# EAGLE design side_switches (EAGLE 5.07)
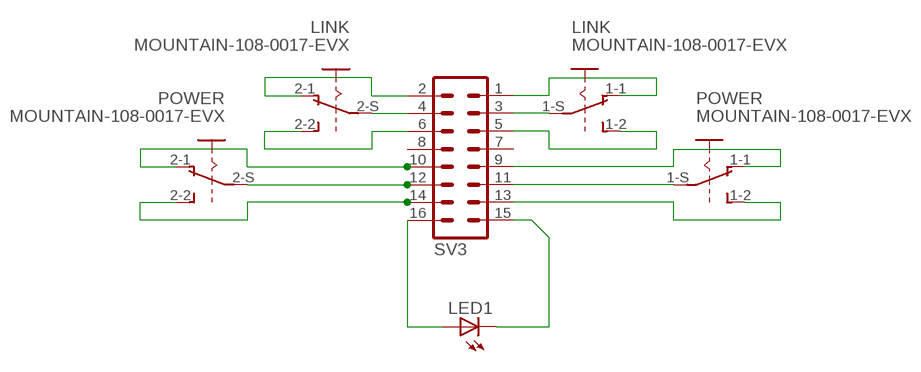
[diagram p0: schematic, sheet 1]

## Parts
LED1  LED3MM  [LED3MM]
LINK  MOUNTAIN-108-0017-EVX  [MOUNTAIN_108-0017-EVX]
POWER  MOUNTAIN-108-0017-EVX  [MOUNTAIN_108-0017-EVX]
SV3  MA08-2  [MA08-2]

## Nets
N$1: LINK.1-S(P) SV3.3
N$2: LINK.2-S(P) SV3.4
N$3: LINK.1-1(O) SV3.1
N$4: LINK.1-2(S) SV3.5
N$5: LINK.2-2(S) SV3.6
N$6: LINK.2-1(O) SV3.2
N$7: POWER.2-1(O) SV3.10
N$8: POWER.2-2(S) SV3.14
N$9: POWER.1-1(O) SV3.9
N$10: POWER.1-2(S) SV3.13
N$11: POWER.1-S(P) SV3.11
N$12: POWER.2-S(P) SV3.12
N$16: LED1.A SV3.16
N$17: LED1.K(C) SV3.15
Unconnected: SV3.7 SV3.8

## Library data of the parts
LED1 = led:LED: LED OSRAM: - CHIPLED LG R971, LG N971, LY N971, LG Q971, LY Q971, LO R971, LY R971 LH N974, LH R974 LS Q976, LO Q976, LY Q976 LO Q996 - Hyper CHIPLED LW Q18S LB Q993, LB Q99A, LB R99A - SideLED LS A670, LO A670, LY A670, LG A670, LP A670 LB A673, LV A673, LT A673, LW A673 LH A674 LY A675 LS A676, LA A676, LO A676, LY A676, LW A676 LS A679, LY A679, LG A679 - Hyper Micro SIDELED® LS Y876, LA Y876, LO Y876, LY Y876 LT Y87S - SmartLED LW L88C, LW L88S LB L89C, LB L89S, LG L890 LS L89K, LO L89K, LY L89K LS L896, LA L896, LO L896, LY L896 - TOPLED LS T670, LO T670, LY T670, LG T670, LP T670 LSG T670, LSP T670, LSY T670, LOP T670, LYG T670 LG T671, LOG T671, LSG T671 LB T673, LV T673, LT T673, LW T673 LH T674 LS T676, LA T676, LO T676, LY T676, LB T676, LH T676, LSB T676, LW T676 LB T67C, LV T67C, LT T67C, LS T67K, LO T67K, LY T67K, LW E67C LS E67B, LA E67B, LO E67B, LY E67B, LB E67C, LV E67C, LT E67C LW T67C LS T679, LY T679, LG T679 LS T770, LO T770, LY T770, LG T770, LP T770 LB T773, LV T773, LT T773, LW T773 LH T774 LS E675, LA E675, LY E675, LS T675 LS T776, LA T776, LO T776, LY T776, LB T776 LHGB T686 LT T68C, LB T68C - Hyper Mini TOPLED® LB M676 - Mini TOPLED Santana® LG M470 LS M47K, LO M47K, LY M47K Source: http://www.osram.convergy.de LUXEON: - LUMILED® LXK2-PW12-R00, LXK2-PW12-S00, LXK2-PW14-U00, LXK2-PW14-V00 LXK2-PM12-R00, LXK2-PM12-S00, LXK2-PM14-U00 LXK2-PE12-Q00, LXK2-PE12-R00, LXK2-PE12-S00, LXK2-PE14-T00, LXK2-PE14-U00 LXK2-PB12-K00, LXK2-PB12-L00, LXK2-PB12-M00, LXK2-PB14-N00, LXK2-PB14-P00, LXK2-PB14-Q00 LXK2-PR12-L00, LXK2-PR12-M00, LXK2-PR14-Q00, LXK2-PR14-R00 LXK2-PD12-Q00, LXK2-PD12-R00, LXK2-PD12-S00 LXK2-PH12-R00, LXK2-PH12-S00 LXK2-PL12-P00, LXK2-PL12-Q00, LXK2-PL12-R00 Source: www.luxeon.com KINGBRIGHT: KA-3528ASYC Source: www.kingbright.com
LINK POWER = joakim:MOUNTAIN-108-0017-EVX: Mountain 108-0017-evx switch
SV3 = con-lstb:MA08-2: PIN HEADER

## Board
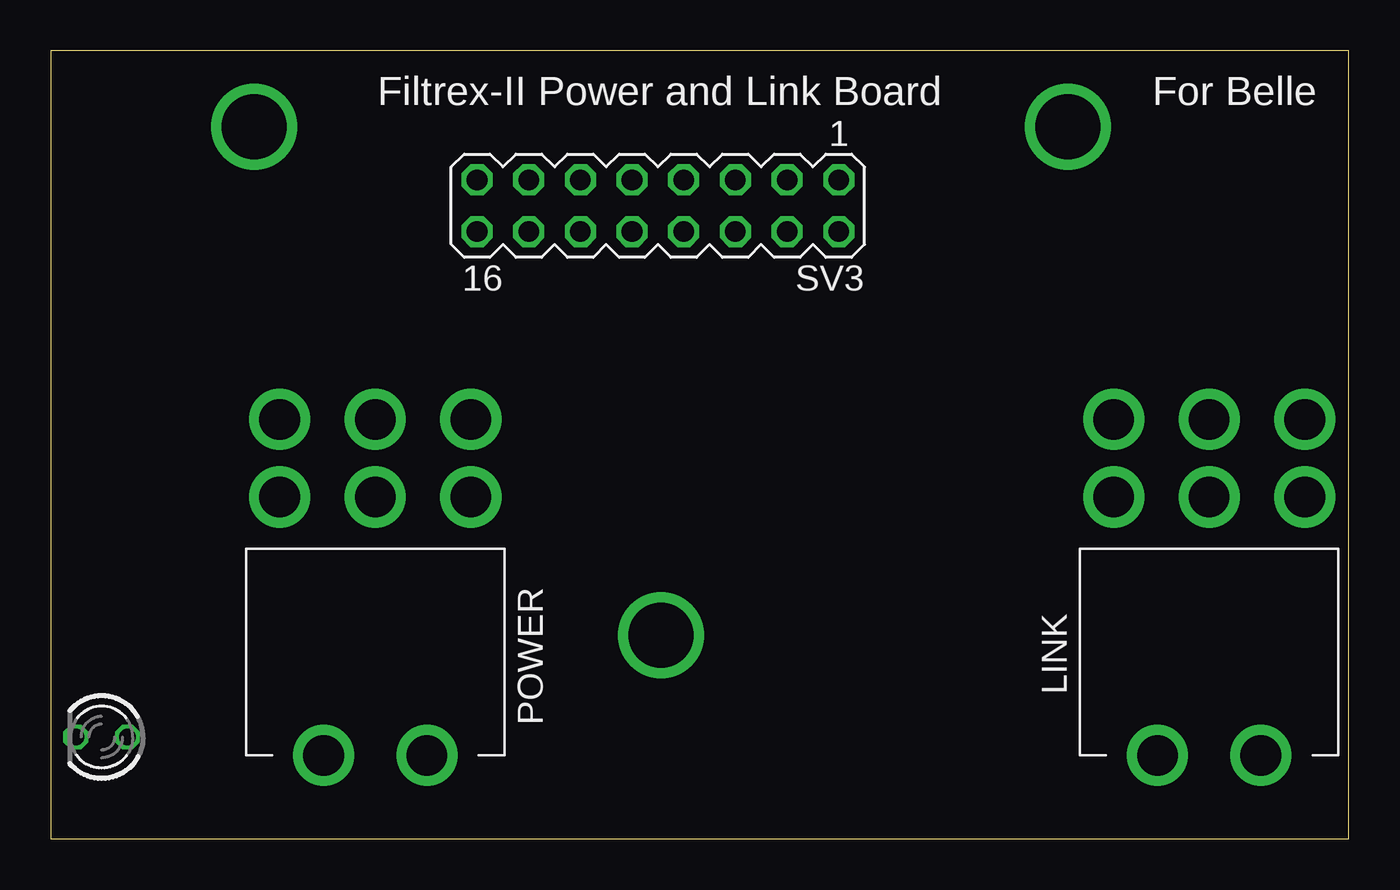
[diagram p1: board, top side]
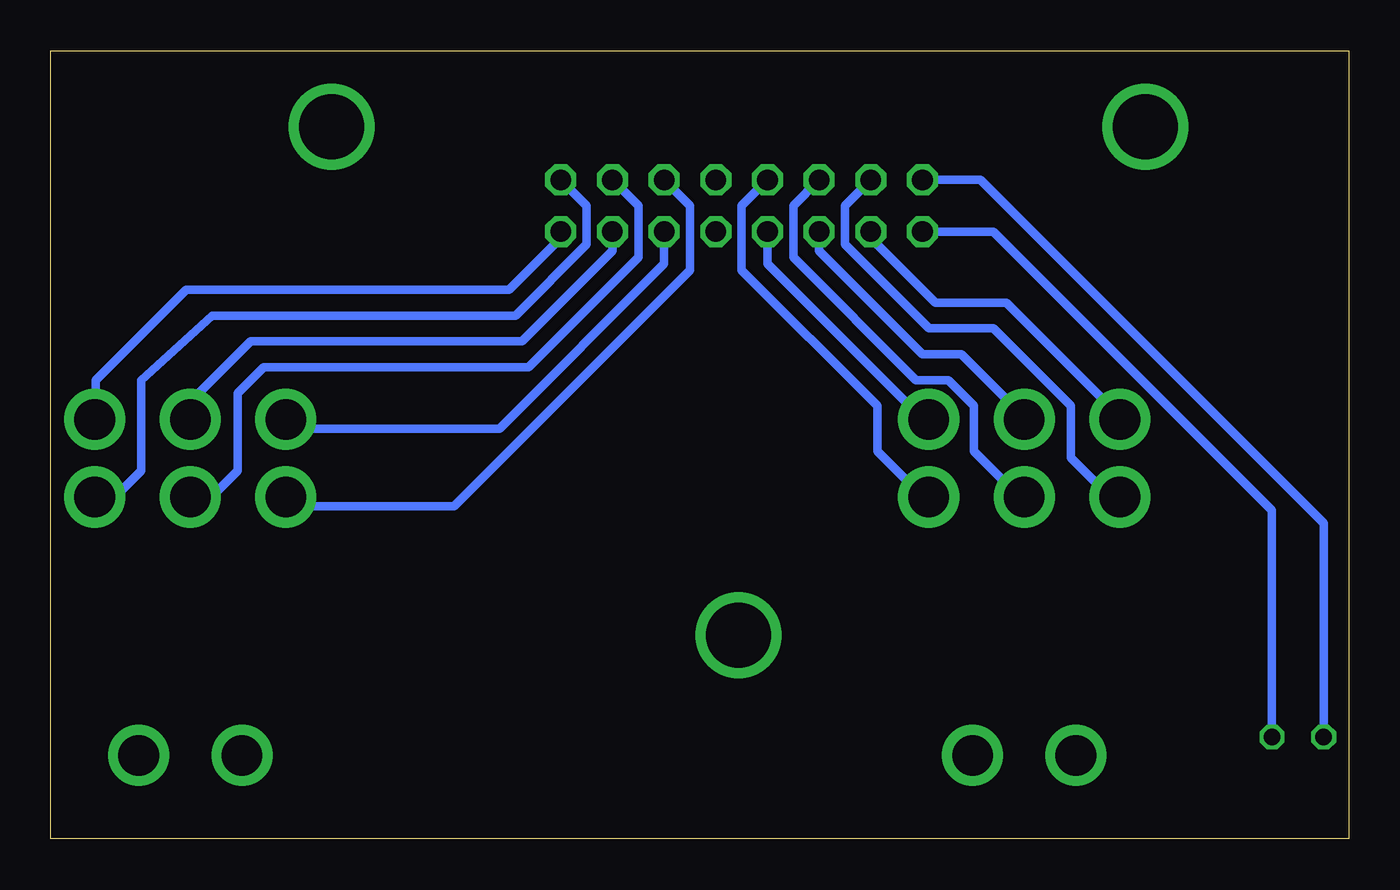
[diagram p2: board, bottom side, seen from below]

Size 63.8 x 38.73 mm. Coordinates in mm from the lower left corner, seen from the top.
Outline: 0,0 63.8,0 63.8,38.73 0,38.73 0,0
Copper layers (1*16): Top 0.035mm / dielectric 1.5mm / Bottom 0.035mm
Design rules "8mils": minimum track width 8mil, minimum drill 0.6mm, track to track 8mil, track to pad 8mil, pad to pad 8mil, via to via 8mil, smd to smd 0mil, copper to edge 20mil, drill to drill 10mil, minimum pad ring 8mil, minimum via ring 8mil, stop-mask expansion 0mil, vias tented up to drill 0mil, thermal gap 10mil

### Footprints (pad centres in the part's own frame; a part is rotated, then mirrored left to right if it is on the bottom)
LED3MM = drill 0.813 octagon: A -1.27,0; K 1.27,0
MOUNTAIN_108-0017-EVX = drill 2 round: 1-1 -4.699,-6.35; 1-2 4.699,-6.35; 1-S 0,-6.35; 2-1 -4.699,-10.16; 2-2 4.699,-10.16; 2-S 0,-10.16; P$7 2.54,6.35; P$8 -2.54,6.35
MA08-2 = drill 1.016 octagon: 1 -8.89,-1.27; 2 -8.89,1.27; 3 -6.35,-1.27; 4 -6.35,1.27; 5 -3.81,-1.27; 6 -3.81,1.27; 7 -1.27,-1.27; 8 -1.27,1.27; 9 1.27,-1.27; 10 1.27,1.27; 11 3.81,-1.27; 12 3.81,1.27; 13 6.35,-1.27; 14 6.35,1.27; 15 8.89,-1.27; 16 8.89,1.27

### Placement (x,y rotation side)
LED1  2.5,5 180 top
LINK  56.95,10.45 180 top
POWER  15.95,10.45 180 top
SV3  29.84,31.11 180 top

### Tracks (layer width: path | path; a pad name or v marks a point on that pad's centre or on a via)
N$1
  Bottom 0.406: LINK.1-S 56.36,16.35 54.61,18.1 54.61,21.91 53.34,23.18 40.32,23.18 34.92,28.57 34.92,31.11 SV3.3
N$2
  Bottom 0.406: LINK.2-S 56.95,21.47 53.98,24.45 40.64,24.45 36.2,28.89 SV3.4
N$3
  Bottom 0.406: LINK.1-1 61.12,16.35 59.37,18.1 59.37,22.54 55.88,25.72 40.96,25.72 37.47,29.21 37.47,31.11 SV3.1
N$4
  Bottom 0.406: SV3.5 32.38,31.11 32.38,27.94 43.98,16.35 51.8,16.35 LINK.1-2
N$5
  Bottom 0.406: LINK.2-2 52.39,20.64 arc-90 51.91,20.16 41.75,20.16 33.66,28.26 SV3.6
N$6
  Bottom 0.406: SV3.2 38.73,29.53 41.27,26.99 57.15,26.99 61.59,22.54 61.59,20.21 LINK.2-1
N$7
  Bottom 0.406: POWER.2-1 20.8,20.48 28.57,28.26 SV3.10
N$8
  Bottom 0.406: POWER.2-2 11.25,20.78 16.83,26.35 20.32,26.35 23.5,29.53 SV3.14
N$9
  Bottom 0.406: POWER.1-1 20.8,16.67 23.18,19.05 23.18,21.27 29.84,27.94 29.84,31.11 SV3.9
N$10
  Bottom 0.406: POWER.1-2 11.27,16.35 13.65,18.73 13.65,21.27 17.46,25.08 20.64,25.08 24.77,29.21 24.77,31.11 SV3.13
N$11
  Bottom 0.406: POWER.1-S 16.03,16.67 18.41,19.05 18.41,21.27 19.68,22.54 21.27,22.54 27.3,28.57 27.3,31.11 SV3.11
N$12
  Bottom 0.406: POWER.2-S 15.95,20.71 19.05,23.81 20.95,23.81 26.04,28.89 SV3.12
N$13  (via drill 3.2)
  other vias: 10,35
N$14  (via drill 3.2)
  other vias: 50,35
N$15  (via drill 3.2)
  other vias: 30,10
N$16
  Bottom 0.406: LED1.A 3.77,16.15 17.46,29.84 SV3.16
N$17
  Bottom 0.406: LED1.K 1.23,15.52 18.1,32.38 SV3.15

### Text on the board
tPlace: Filtrex-II Power and Link Board | For Belle